# EAGLE board Testing_board_CIDIC_rev_aamaya (EAGLE 7.5.0), part 1 of 2
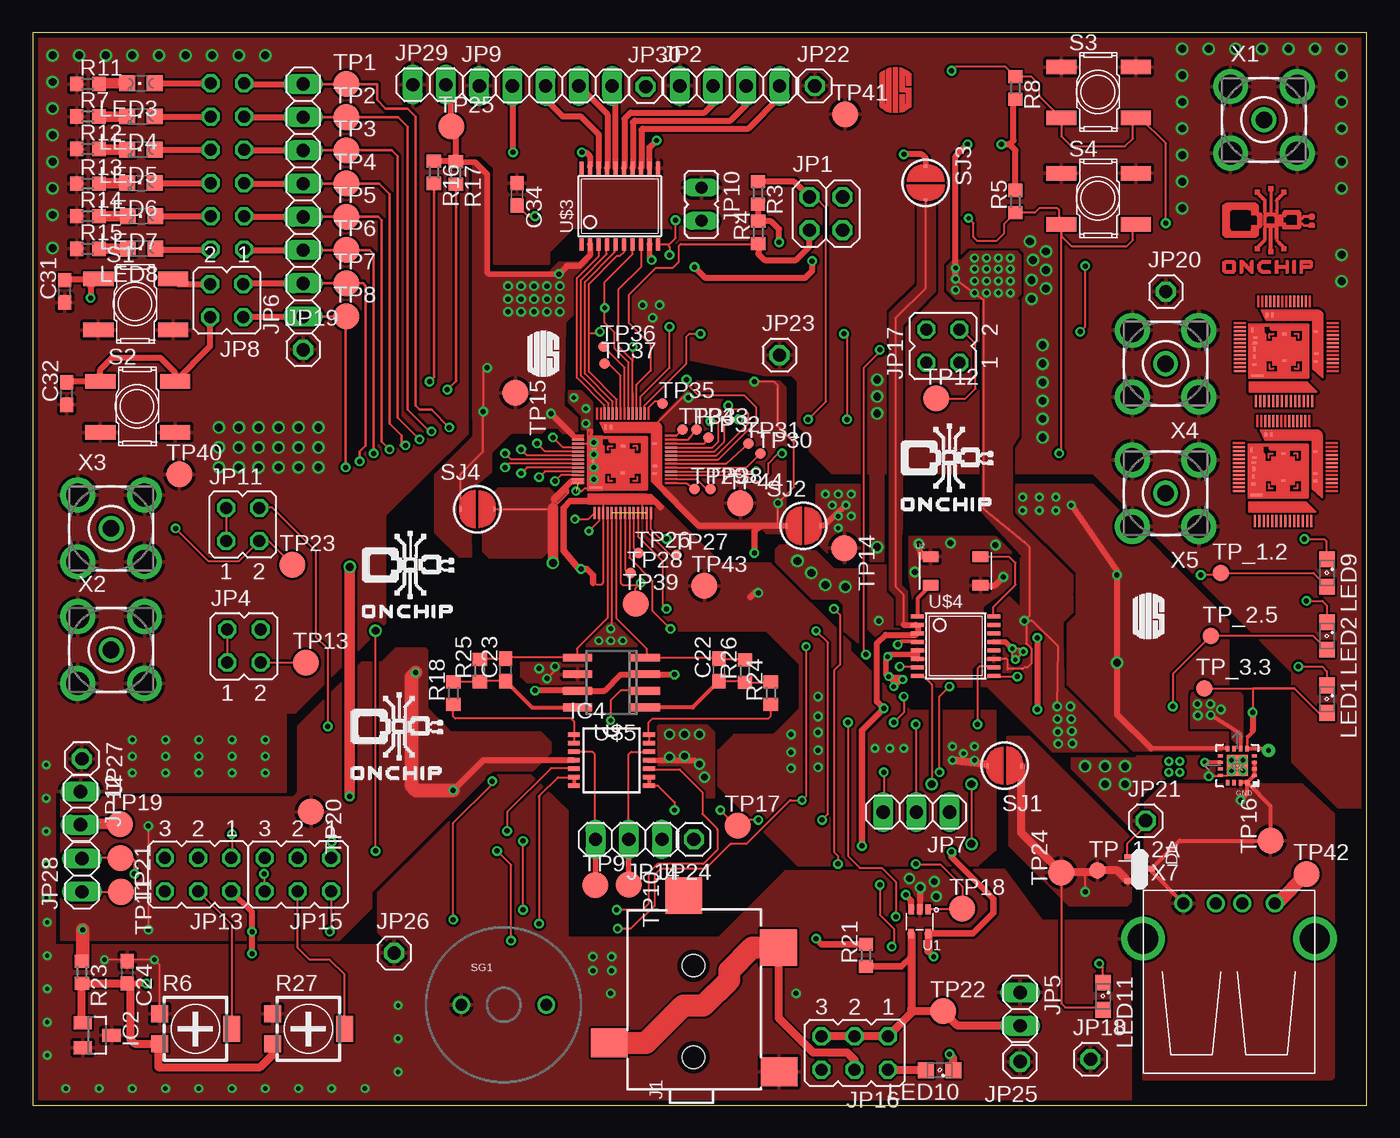
[diagram p2: board, top side]
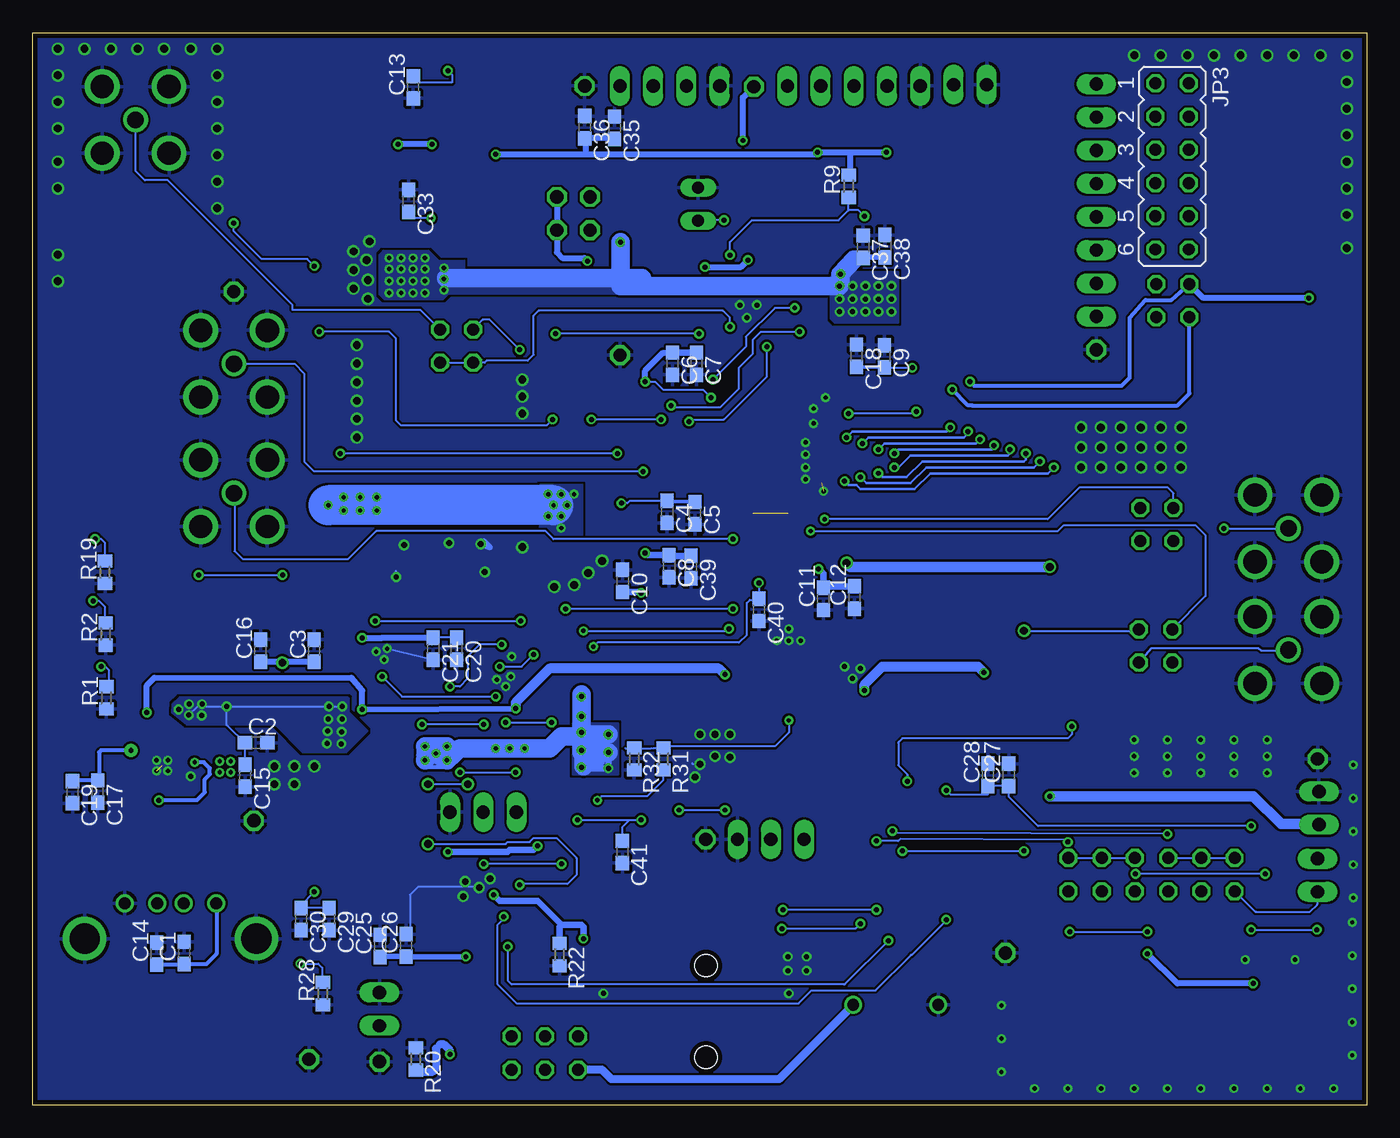
[diagram p3: board, bottom side, seen from below]

Size 102 x 82 mm. Coordinates in mm from the lower left corner, seen from the top.
Outline: 0,0 102,0 102,82 0,82 0,0
Copper layers (1*16): Top 0.0356mm / dielectric 1.5011mm / Bottom 0.0356mm
Design rules "oshpark-2layer": minimum track width 6mil, minimum drill 13mil, track to track 6mil, track to pad 6mil, pad to pad 6mil, via to via 6mil, smd to smd 6mil, copper to edge 15mil, drill to drill 6mil, minimum pad ring 7mil, minimum via ring 7mil, stop-mask expansion 2.5mil, vias tented up to drill 0mil, thermal gap 10mil
Net classes: 1 diff_pair: width 0.152 mm

## Footprints (pad centres in the part's own frame; a part is rotated, then mirrored left to right if it is on the bottom)
C0603 = smd 1.1 x 1: 1 -0.85,0; 2 0.85,0
SOT-23 = smd 0.4 x 0.5: 1 -0.889,-1.016; 2 0.939,-1.016; 3 0,0.816
LFCSP_LQ-16 = smd 0.4 x 0.25: 1 -1.3,0.75; 2 -1.3,0.25; 3 -1.3,-0.25; 4 -1.3,-0.75; 9 1.3,-0.75; 10 1.3,-0.25; 11 1.3,0.25; 12 1.3,0.75 | smd 0.25 x 0.4: 5 -0.75,-1.3; 6 -0.25,-1.3; 7 0.25,-1.3; 8 0.75,-1.3; 13 0.75,1.3; 14 0.25,1.3; 15 -0.25,1.3; 16 -0.75,1.3 | smd 1.6 x 1.6: EXP 0,0
SOT23 = smd 1 x 1.4: 1 -0.95,-1.1; 2 0.95,-1.1; 3 0,1.1
TSSOP14 = smd 0.9 x 0.35: 1 -2.875,1.95; 2 -2.875,1.3; 3 -2.875,0.65; 4 -2.875,0; 5 -2.875,-0.65; 6 -2.875,-1.3; 7 -2.875,-1.95; 8 2.875,-1.95; 9 2.875,-1.3; 10 2.875,-0.65; 11 2.875,0; 12 2.875,0.65; 13 2.875,1.3; 14 2.875,1.95
STEREOJACK2.5MM_SMD = smd 2.2 x 2.8: 1 -1.1,-6.55; 3 1.1,6.45 | smd 2.8 x 2.8: 2 8.4,-6.5; 4 12.35,0.75 | hole 1.7: 0,0; 7,0
2X02 = drill 1.016 octagon: 1 -1.27,-1.27; 2 -1.27,1.27; 3 1.27,-1.27; 4 1.27,1.27
1X04 = drill 1.016 long: 1 -3.81,0; 2 -1.27,0; 3 1.27,0; 4 3.81,0
JP6Q = drill 0.914 octagon: 1 -6.35,-1.27; 2 -6.35,1.27; 3 -3.81,-1.27; 4 -3.81,1.27; 5 -1.27,-1.27; 6 -1.27,1.27; 7 1.27,-1.27; 8 1.27,1.27; 9 3.81,-1.27; 10 3.81,1.27; 11 6.35,-1.27; 12 6.35,1.27
JP2Q = drill 0.914 octagon: 1 -1.27,-1.27; 2 1.27,-1.27; 3 -1.27,1.27; 4 1.27,1.27
1X02 = drill 1.016 long: 1 -1.27,0; 2 1.27,0
1X08 = drill 1.016 long: 1 -8.89,0; 2 -6.35,0; 3 -3.81,0; 4 -1.27,0; 5 1.27,0; 6 3.81,0; 7 6.35,0; 8 8.89,0
1X03 = drill 1.016 long: 1 -2.54,0; 2 0,0; 3 2.54,0
1X05 = drill 1.016 long: 1 -5.08,0; 2 -2.54,0; 3 0,0; 4 2.54,0; 5 5.08,0
JP1 = drill 0.914 long: 1 0,-1.27; 2 0,1.27
JP3Q = drill 0.914 octagon: 1 -2.54,-1.27; 2 -2.54,1.27; 3 0,-1.27; 4 0,1.27; 5 2.54,-1.27; 6 2.54,1.27
1X01 = drill 1.016 octagon: 1 0,0
SML0805 = smd 1.2 x 1.2: A 1.05,0; C -1.05,0
CHIPLED_0805 = smd 1.2 x 1.2: A 0,-1.05; C 0,1.05
R0603 = smd 1 x 1.1: 1 -0.85,0; 2 0.85,0
RTRIM4G/J = smd 1.3 x 1.3: 1 -1.15,-2.75; 3 1.15,-2.75 | smd 2 x 1.3: 2 0,2.75
SKHMPXE010 = smd 2.3 x 1.1: 1 -3.1,1.9; 2 2.6,1.9; 3 -3.1,-2; 4 2.6,-2
BUZZER-12MM-NS = drill 0.9: + 3.25,0; - -3.25,0
SJ_ROUND = smd 0.152 x 0.305: 1 -1.27,0; 2 1.295,0
TP20R = smd 2 x 2: TP 0,0
TP08R = smd 0.8 x 0.8: TP 0,0
B1,27 = smd 1.27 x 1.27: TP 0,0
SC-70-5 = smd 0.4 x 0.75: 1 -0.65,-0.925; 2 0,-0.925; 3 0.65,-0.925; 4 0.65,0.925; 5 -0.65,0.925
5X3.2 = smd 1.2 x 0.8: 1 -1.4,-0.9; 2 2.4,-0.9; 3 2.4,1.3; 4 -1.4,1.3
CIDIC_AXI_UC_TEST_DIE = smd 0.152 x 0.914: ADC_AXI_CLK -1.829,-4.115; ADC_AXI_IN -1.168,-4.115; ADC_AXI_IP -0.508,-4.115; ADC_AXI_RST -2.159,-4.115; AVDD@1 1.499,-4.115; AVDD@2 -1.499,-4.115; AVSS@1 1.829,-4.115; AVSS@2 0.838,-4.115; AVSS@3 0.178,-4.115; AVSS@4 -0.838,-4.115; AXI_CLK 1.372,3.505; AXI_RST 1.676,3.505; DAC_AXI_OUT 1.168,-4.115; H_CLK_200 2.159,-4.115; SPI_AXI_MASTER_CEB 1.067,3.505; SPI_AXI_MASTER_DATA 0.762,3.505; SPI_AXI_MASTER_DOUT -0.457,3.505; SPI_AXI_MASTER_SCLK 0.457,3.505; SPI_AXI_SLAVE_CEB -0.762,3.505; SPI_AXI_SLAVE_DATA -1.067,3.505; SPI_AXI_SLAVE_SCLK -1.372,3.505; VREF_ADC -0.178,-4.115; VREF_DAC 0.508,-4.115 | smd 0.914 x 0.152: GPIO00_PAD -3.404,0.914; GPIO01_PAD -3.404,0.61; GPIO02_PAD -3.404,0.305; GPIO03_PAD -3.404,0; GPIO04_PAD -3.404,-0.305; GPIO05_PAD -3.404,-0.61; GPIO06_PAD -3.404,-0.914; GPIO07_PAD -3.404,-1.219; H_CEB 3.708,0.61; H_CLK 3.708,0; H_CLK_10 3.708,-0.914; H_DATA 3.708,0.914; H_DOUT 3.708,0.305; H_RST 3.708,-1.219; N$10000 -3.404,-1.829; VDDPOC -3.404,-1.524; VDDPST -3.404,1.524; VSSPST@2 -3.404,1.219; VSSPST@3 -2.057,-2.159 | smd 0.152 x 0.305: VDD@1 -1.321,2.464; VDD@2 -0.889,2.464; VSS@2 -2.438,1.295; VSS@5 -2.261,-0.152; VSS@6 -2.286,-0.711 | smd 0.305 x 0.152: VDD@3 2.438,1.194; VDD@4 2.464,-0.508; VDD@5 2.438,-1.092; VSS@1 0.025,1.016; VSS@3 -2.235,0.33; VSS@4 0,-1.041; VSS@7 -2.286,-1.321; VSS@8 -2.21,0.737
TSSOP20 = smd 0.305 x 0.991: 1 -2.925,-2.918; 2 -2.275,-2.918; 3 -1.625,-2.918; 4 -0.975,-2.918; 5 -0.325,-2.918; 6 0.325,-2.918; 7 0.975,-2.918; 8 1.625,-2.918; 9 2.275,-2.918; 10 2.925,-2.918; 11 2.925,2.918; 12 2.275,2.918; 13 1.625,2.918; 14 0.975,2.918; 15 0.325,2.918; 16 -0.325,2.918; 17 -0.975,2.918; 18 -1.625,2.918; 19 -2.275,2.918; 20 -2.925,2.918
TSSOP16 = smd 0.305 x 0.991: 1 -2.275,-2.918; 2 -1.625,-2.918; 3 -0.975,-2.918; 4 -0.325,-2.918; 5 0.325,-2.918; 6 0.975,-2.918; 7 1.625,-2.918; 8 2.275,-2.918; 9 2.275,2.918; 10 1.625,2.918; 11 0.975,2.918; 12 0.325,2.918; 13 -0.325,2.918; 14 -0.975,2.918; 15 -1.625,2.918; 16 -2.275,2.918
SO8 = smd 0.6 x 2.2: 1 -1.905,-2.6; 2 -0.635,-2.6; 3 0.635,-2.6; 4 1.905,-2.6; 5 1.905,2.6; 6 0.635,2.6; 7 -0.635,2.6; 8 -1.905,2.6
BU-SMA-V = drill 1.27: 1 0,0 | drill 1.778: 2 -2.55,2.55; 3 2.55,2.55; 4 2.55,-2.55; 5 -2.55,-2.55
USB-A-H = drill 0.914: D+ 2.718,-1.003; D- 2.718,1.003; GND 2.718,-3.493; VBUS 2.718,3.493 | drill 2.311: P$5 0,-6.566; P$6 0,6.566

## Placement (x,y rotation side)
C1  10-22uF  [C0603]  90.42,11.63 90 bottom
C2  10-22uF  [C0603]  84.91,27.71 0 bottom
C3  10-22uF  [C0603]  80.47,34.75 90 bottom
C4  100n  [C0603]  53.49,45.36 270 bottom
C5  100n  [C0603]  51.36,45.26 270 bottom
C6  100n  [C0603]  53.09,56.69 270 bottom
C7  100n  [C0603]  51.26,56.69 270 bottom
C8  100n  [C0603]  53.34,41.2 270 bottom
C9  100n  [C0603]  36.88,57.25 270 bottom
C10  10u  [C0603]  56.9,40.08 270 bottom
C11  100n  [C0603]  41.55,38.71 90 bottom
C12  100n  [C0603]  39.17,38.81 90 bottom
C13  10u  [C0603]  72.9,77.83 90 bottom
C14  100nF  [C0603]  92.51,11.58 90 bottom
C15  100nF  [C0603]  85.75,25.2 270 bottom
C16  100nF  [C0603]  84.58,34.75 90 bottom
C17  10-22uF  [C0603]  97.03,23.98 270 bottom
C18  10u  [C0603]  39.01,57.3 270 bottom
C19  100nF  [C0603]  98.96,23.93 270 bottom
C20  1uF  [C0603]  69.6,34.9 270 bottom
C21  100nF  [C0603]  71.37,34.9 270 bottom
C22  4pF  [C0603]  52.48,33.27 90 top
C23  4pF  [C0603]  36.17,33.27 90 top
C24  10u  [C0603]  7.21,10.16 270 top
C25  1uF  [C0603]  75.44,12.17 90 bottom
C26  100nF  [C0603]  73.46,12.22 90 bottom
C27  1uF  [C0603]  27.38,25.25 90 bottom
C28  100nF  [C0603]  28.96,25.25 90 bottom
C29  10-22uF  [C0603]  79.35,14.22 270 bottom
C30  100nF  [C0603]  81.48,14.22 270 bottom
C31  10u  [C0603]  2.44,62.23 90 top
C32  10u  [C0603]  2.59,54.41 90 top
C33  10u  [C0603]  73.25,69.14 270 bottom
C34  10u  [C0603]  37.03,69.65 270 top
C35  100n  [C0603]  57.51,74.73 270 bottom
C36  10u  [C0603]  59.79,74.78 270 bottom
C37  100n  [C0603]  38.51,65.63 270 bottom
C38  10u  [C0603]  36.83,65.68 270 bottom
C39  10u  [C0603]  51.66,41.15 270 bottom
C40  100nF  [C0603]  46.48,37.87 270 bottom
C41  100nF  [C0603]  56.92,19.35 270 bottom
D1  [SOT-23]  84.73,18.08 270 top
GND  ADP322  [LFCSP_LQ-16]  92.1,25.96 180 top
IC2  AD1580ARTZ  [SOT23]  4.93,5.33 270 top
IC4  MAX4234RU  [TSSOP14]  44.25,26.37 0 top
J1  [STEREOJACK2.5MM_SMD]  50.52,3.66 90 top
JP1  [2X02]  60.66,68.17 0 top
JP2  [1X04]  53.29,77.93 0 top
JP3  [JP6Q]  14.88,71.78 270 bottom
JP4  [JP2Q]  16.15,35.1 0 top
JP5  [1X02]  75.49,7.34 270 top
JP6  [1X08]  20.68,69.19 90 top
JP7  [1X03]  67.56,22.4 180 top
JP8  [JP2Q]  14.83,61.52 180 top
JP9  [1X05]  39.22,77.93 0 top
JP10  [JP1]  51.13,68.88 180 top
JP11  [JP2Q]  16.05,44.4 0 top
JP12  [1X02]  3.66,22.71 270 top
JP13  [JP3Q]  12.65,17.63 180 top
JP14  [1X03]  45.57,20.32 180 top
JP15  [JP3Q]  20.27,17.63 180 top
JP16  [JP3Q]  62.84,3.99 180 top
JP17  [JP2Q]  69.6,58.04 90 top
JP18  [1X01]  80.87,3.51 0 top
JP19  [1X01]  20.68,57.76 0 top
JP20  [1X01]  86.63,62.21 0 top
JP21  [1X01]  85.09,21.74 0 top
JP22  [1X01]  59.79,77.93 0 top
JP23  [1X01]  57.1,57.35 0 top
JP24  [1X01]  50.55,20.32 180 top
JP25  [1X01]  75.49,3.33 180 top
JP26  [1X01]  27.64,11.63 0 top
JP27  [1X01]  3.76,26.47 270 top
JP28  [1X02]  3.76,17.58 90 top
JP29  [1X02]  30.33,78.03 0 top
JP30  [1X01]  46.86,77.88 0 top
LED1  [SML0805]  98.96,31.04 270 top
LED2  [SML0805]  98.96,35.86 270 top
LED3  [CHIPLED_0805]  8.28,78.13 90 top
LED4  [CHIPLED_0805]  8.28,75.59 90 top
LED5  [CHIPLED_0805]  8.28,73.05 90 top
LED6  [CHIPLED_0805]  8.28,70.51 90 top
LED7  [CHIPLED_0805]  8.33,67.97 90 top
LED8  [CHIPLED_0805]  8.33,65.48 90 top
LED9  [SML0805]  98.96,40.69 270 top
LED10  [SML0805]  69.34,2.67 180 top
LED11  [SML0805]  81.84,8.33 270 top
R1  1800  [R0603]  96.37,31.14 90 bottom
R2  1800  [R0603]  96.42,36.02 90 bottom
R3  10k  [R0603]  55.45,69.75 270 top
R4  10k  [R0603]  55.47,66.73 90 top
R5  10k  [R0603]  75.13,69.09 90 top
R6  [RTRIM4G/J]  12.45,5.84 270 top
R7  1800  [R0603]  4.22,75.59 0 top
R8  10k  [R0603]  75.13,77.77 270 top
R9  200k  [R0603]  39.62,70.26 90 bottom
R11  1800  [R0603]  4.22,78.08 0 top
R12  1800  [R0603]  4.22,73.1 0 top
R13  1800  [R0603]  4.22,70.46 0 top
R14  1800  [R0603]  4.22,67.97 0 top
R15  1800  [R0603]  4.22,65.48 0 top
R16  10k  [R0603]  30.68,71.32 270 top
R17  10k  [R0603]  32.36,71.27 270 top
R18  27k  [R0603]  32.16,31.5 90 top
R19  100  [R0603]  96.47,40.74 90 bottom
R20  1000  [R0603]  72.69,3.53 270 bottom
R21  27k  [R0603]  63.7,11.46 90 top
R22  10k  [R0603]  61.72,11.51 270 bottom
R23  1300  [R0603]  3.76,10.16 270 top
R24  27k  [R0603]  56.44,31.5 90 top
R25  10k  [R0603]  34.19,33.22 90 top
R26  10k  [R0603]  54.46,33.17 90 top
R27  [RTRIM4G/J]  21.08,5.84 270 top
R28  100  [R0603]  79.81,8.53 90 bottom
R31  10k  [R0603]  53.77,26.47 270 bottom
R32  10k  [R0603]  56.01,26.47 270 bottom
S1  CKN9104CT-NDS  [SKHMPXE010]  8.13,61.26 0 top
S2  CKN9104CT-NDS  [SKHMPXE010]  8.28,53.44 0 top
S3  CKN9104CT-NDS  [SKHMPXE010]  81.74,77.47 0 top
S4  CKN9104CT-NDS  [SKHMPXE010]  81.74,69.34 0 top
SG1  BUZZERNS  [BUZZER-12MM-NS]  36.02,7.67 0 top
SJ1  JUMPERAVDD  [SJ_ROUND]  74.32,25.96 180 top
SJ2  JUMPERDVDD  [SJ_ROUND]  58.93,44.3 0 top
SJ3  JUMPERLEVEL  [SJ_ROUND]  68.28,70.51 270 top
SJ4  JUMPERAVDD  [SJ_ROUND]  33.99,45.57 0 top
TP1  TPTP20R  [TP20R]  23.98,78.08 0 top
TP2  TPTP20R  [TP20R]  23.98,75.54 0 top
TP3  TPTP20R  [TP20R]  23.98,73 0 top
TP4  TPTP20R  [TP20R]  23.98,70.46 0 top
TP5  TPTP20R  [TP20R]  23.98,67.92 0 top
TP6  TPTP20R  [TP20R]  23.98,65.38 0 top
TP7  TPTP20R  [TP20R]  23.98,62.84 0 top
TP8  TPTP20R  [TP20R]  23.98,60.3 0 top
TP9  TPTP20R  [TP20R]  43.03,16.81 0 top
TP10  TPTP20R  [TP20R]  45.57,16.87 270 top
TP11  TPTP20R  [TP20R]  6.76,16.31 270 top
TP12  TPTP20R  [TP20R]  69.09,54.03 0 top
TP13  TPTP20R  [TP20R]  20.88,33.83 0 top
TP14  TPTP20R  [TP20R]  62.05,42.6 270 top
TP15  TPTP20R  [TP20R]  36.91,54.46 270 top
TP16  TPTP20R  [TP20R]  94.64,20.22 90 top
TP17  TPTP20R  [TP20R]  53.9,21.39 0 top
TP18  TPTP20R  [TP20R]  71.07,15.01 0 top
TP19  TPTP20R  [TP20R]  6.65,21.49 0 top
TP20  TPTP20R  [TP20R]  21.29,22.43 270 top
TP21  TPTP20R  [TP20R]  6.71,18.9 270 top
TP22  TPTP20R  [TP20R]  69.6,7.19 0 top
TP23  TPTP20R  [TP20R]  19.86,41.3 0 top
TP24  TPTP20R  [TP20R]  78.64,17.78 90 top
TP25  TPTP20R  [TP20R]  32,74.83 0 top
TP26  TPTP08R  [TP08R]  46.33,42.21 0 top
TP27  TPTP08R  [TP08R]  49.23,42.06 0 top
TP28  TPTP08R  [TP08R]  45.72,40.69 0 top
TP29  TPTP08R  [TP08R]  50.6,47.09 0 top
TP30  TPTP08R  [TP08R]  55.63,49.83 0 top
TP31  TPTP08R  [TP08R]  54.71,50.6 0 top
TP32  TPTP08R  [TP08R]  51.66,51.05 0 top
TP33  TPTP08R  [TP08R]  50.75,51.66 0 top
TP34  TPTP08R  [TP08R]  49.68,51.66 0 top
TP35  TPTP08R  [TP08R]  48.16,53.64 0 top
TP36  TPTP08R  [TP08R]  43.66,57.99 0 top
TP37  TPTP08R  [TP08R]  43.74,56.69 0 top
TP38  TPTP08R  [TP08R]  51.82,47.09 0 top
TP39  TPTP20R  [TP20R]  46.1,38.33 0 top
TP40  TPTP20R  [TP20R]  11.2,48.23 0 top
TP41  TPTP20R  [TP20R]  62.1,75.76 0 top
TP42  TPTP20R  [TP20R]  97.38,17.68 0 top
TP43  TPTP20R  [TP20R]  51.36,39.7 0 top
TP44  TPTP20R  [TP20R]  54.1,46.02 0 top
TP_1.2  PTR1B1,27  [B1,27]  90.83,40.69 0 top
TP_1.2A  PTR1B1,27  [B1,27]  81.38,17.93 0 top
TP_2.5  PTR1B1,27  [B1,27]  90.07,35.86 0 top
TP_3.3  PTR1B1,27  [B1,27]  89.56,31.88 0 top
U1  MAX4230  [SC-70-5]  67.82,14.05 180 top
U2  30MHZ-OSCILLATOR  [5X3.2]  70.05,40.64 0 top
U$1  CIDIC_AXI_UC_TEST_DIE  [CIDIC_AXI_UC_TEST_DIE]  45.11,49.38 0 top
U$3  LEVEL_SHIFTER_8  [TSSOP20]  44.88,68.73 0 top
U$4  CY22150KFZXC  [TSSOP16]  70.56,35.1 270 top
U$5  ADA4940  [SO8]  44.25,32.31 90 top
U$6  CIDIC_AXI_UC_TEST_DIE  [CIDIC_AXI_UC_TEST_DIE]  95.61,48.79 0 top
U$7  CIDIC_AXI_UC_TEST_DIE  [CIDIC_AXI_UC_TEST_DIE]  95.68,57.95 0 top
X1  BU-SMA-V  [BU-SMA-V]  94.13,75.34 0 top
X2  BU-SMA-V  [BU-SMA-V]  5.99,34.8 0 top
X3  BU-SMA-V  [BU-SMA-V]  5.99,44.09 0 top
X4  BU-SMA-V  [BU-SMA-V]  86.61,56.69 180 top
X5  BU-SMA-V  [BU-SMA-V]  86.61,46.79 180 top
X7  [USB-A-H]  91.47,12.73 90 top